# EAGLE schematic dan_spedenspelit_eagle_schema (EAGLE 9.1.3)
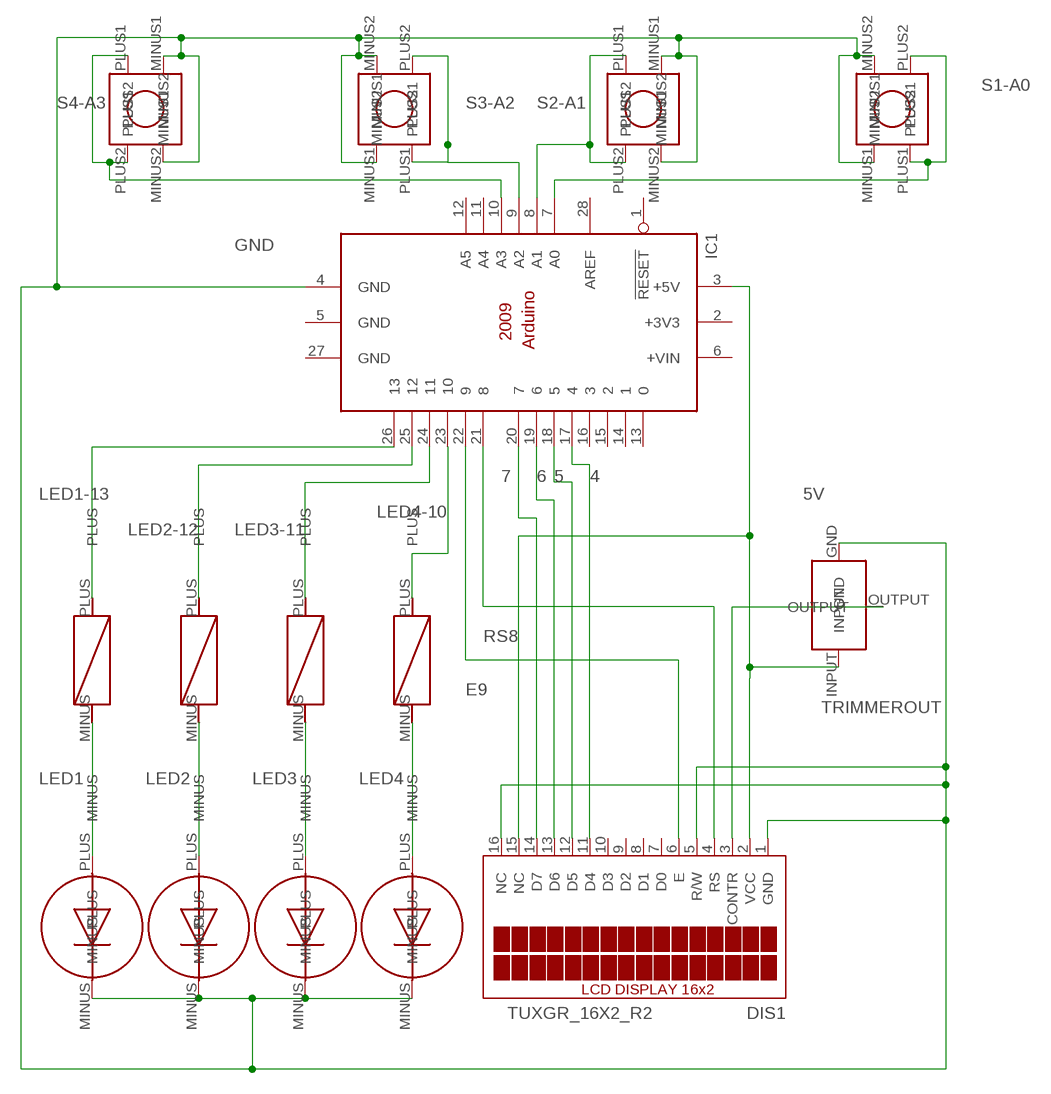
[diagram p0: schematic, sheet 1]

## Parts
DIS1  TUXGR_16X2_R2  [TUXGR_16X2_R2]
IC1  ARDUINO2009_10  [ARDUINO2009]
U$1  DAN_BUTTON1  [DAN_BUTTON1]
U$2  DAN_BUTTON1  [DAN_BUTTON1]
U$3  DAN_BUTTON1  [DAN_BUTTON1]
U$4  DAN_BUTTON1  [DAN_BUTTON1]
U$5  DAN_LED1  [DAN_LED1]
U$6  DAN_LED1  [DAN_LED1]
U$7  DAN_LED1  [DAN_LED1]
U$8  DAN_LED1  [DAN_LED1]
U$9  DAN_RESISTOR1  [DAN_RESISTOR1]
U$10  DAN_RESISTOR1  [DAN_RESISTOR1]
U$11  DAN_RESISTOR1  [DAN_RESISTOR1]
U$12  DAN_RESISTOR1  [DAN_RESISTOR1]
U$13  DAN_TRIMMER1  [DAN_TRIMMER1]

## Nets
4: DIS1.11(D4) IC1.17
5: DIS1.12(D5) IC1.18
5V: DIS1.2(VCC) DIS1.15(NC) IC1.3(+5V) U$13.INPUT
6: DIS1.13(D6) IC1.19
7: DIS1.14(D7) IC1.20
E9: DIS1.6(E) IC1.22
GND: DIS1.1(GND) DIS1.5(R/W) DIS1.16(NC) IC1.4(GND) U$1.MINUS1 U$1.MINUS2 U$2.MINUS1 U$2.MINUS2 U$3.MINUS1 U$3.MINUS2 U$4.MINUS1 U$4.MINUS2 U$5.MINUS U$6.MINUS U$7.MINUS U$8.MINUS U$13.GND
LED1: U$8.PLUS U$12.MINUS
LED1-13: IC1.26 U$12.PLUS
LED2: U$5.PLUS U$11.MINUS
LED2-12: IC1.25 U$11.PLUS
LED3: U$6.PLUS U$10.MINUS
LED3-11: IC1.24 U$10.PLUS
LED4: U$7.PLUS U$9.MINUS
LED4-10: IC1.23 U$9.PLUS
RS8: DIS1.4(RS) IC1.21
S1-A0: IC1.7(A0) U$4.PLUS1 U$4.PLUS2
S2-A1: IC1.8(A1) U$3.PLUS1 U$3.PLUS2
S3-A2: IC1.9(A2) U$2.PLUS1 U$2.PLUS2
S4-A3: IC1.10(A3) U$1.PLUS1 U$1.PLUS2
TRIMMEROUT: DIS1.3(CONTR) U$13.OUTPUT
Unconnected: DIS1.7(D0) DIS1.8(D1) DIS1.9(D2) DIS1.10(D3) IC1.1(!RESET) IC1.6(+VIN) IC1.11(A4) IC1.12(A5) IC1.13 IC1.14 IC1.15 IC1.16 IC1.28(AREF)

## Power pins joined to a net without a drawn wire
+3V3: IC1.2(+3V3)
GND: IC1.5(GND) IC1.27(GND)

## Library data of the parts
DIS1 = display-lcd:TUXGR_16X2_R2: Tuxgraphics LCD display 16x2 characters reflective, without background light Source: tuxgr_12x2_r2.pdf; OC_FARNELL: unknown; OC_NEWARK: unknown
IC1 = arduino:ARDUINO2009_1: The Arduino Duemilanove ("2009") is a microcontroller board based on the ATmega168 or ATmega328. - 14 digital input/output pins (of which 6 can be used as PWM outputs) - 6 analog inputs, a 16 MHz crystal oscillator - USB connection - power jack - ISP header - reset button It contains everything needed to support the microcontroller; simply connect it to a computer with a USB cable or power it with a AC-to-DC adapter or battery to get started http://arduino.cc/en/Main/ArduinoBoardDuemilanove
U$1-U$4 = DAN_BUTTON1:DAN_BUTTON1
U$5-U$8 = DAN_LED1:DAN_LED1
U$9-U$12 = DAN_RESISTOR1:DAN_RESISTOR1
U$13 = DAN_TRIMMER1:DAN_TRIMMER1

## Net classes
0 default: width 1 mm, drill 0.8 mm, clearance 0.6 mm